# Altium schematic sheet MAXIM-ADC2.SchDoc
size B
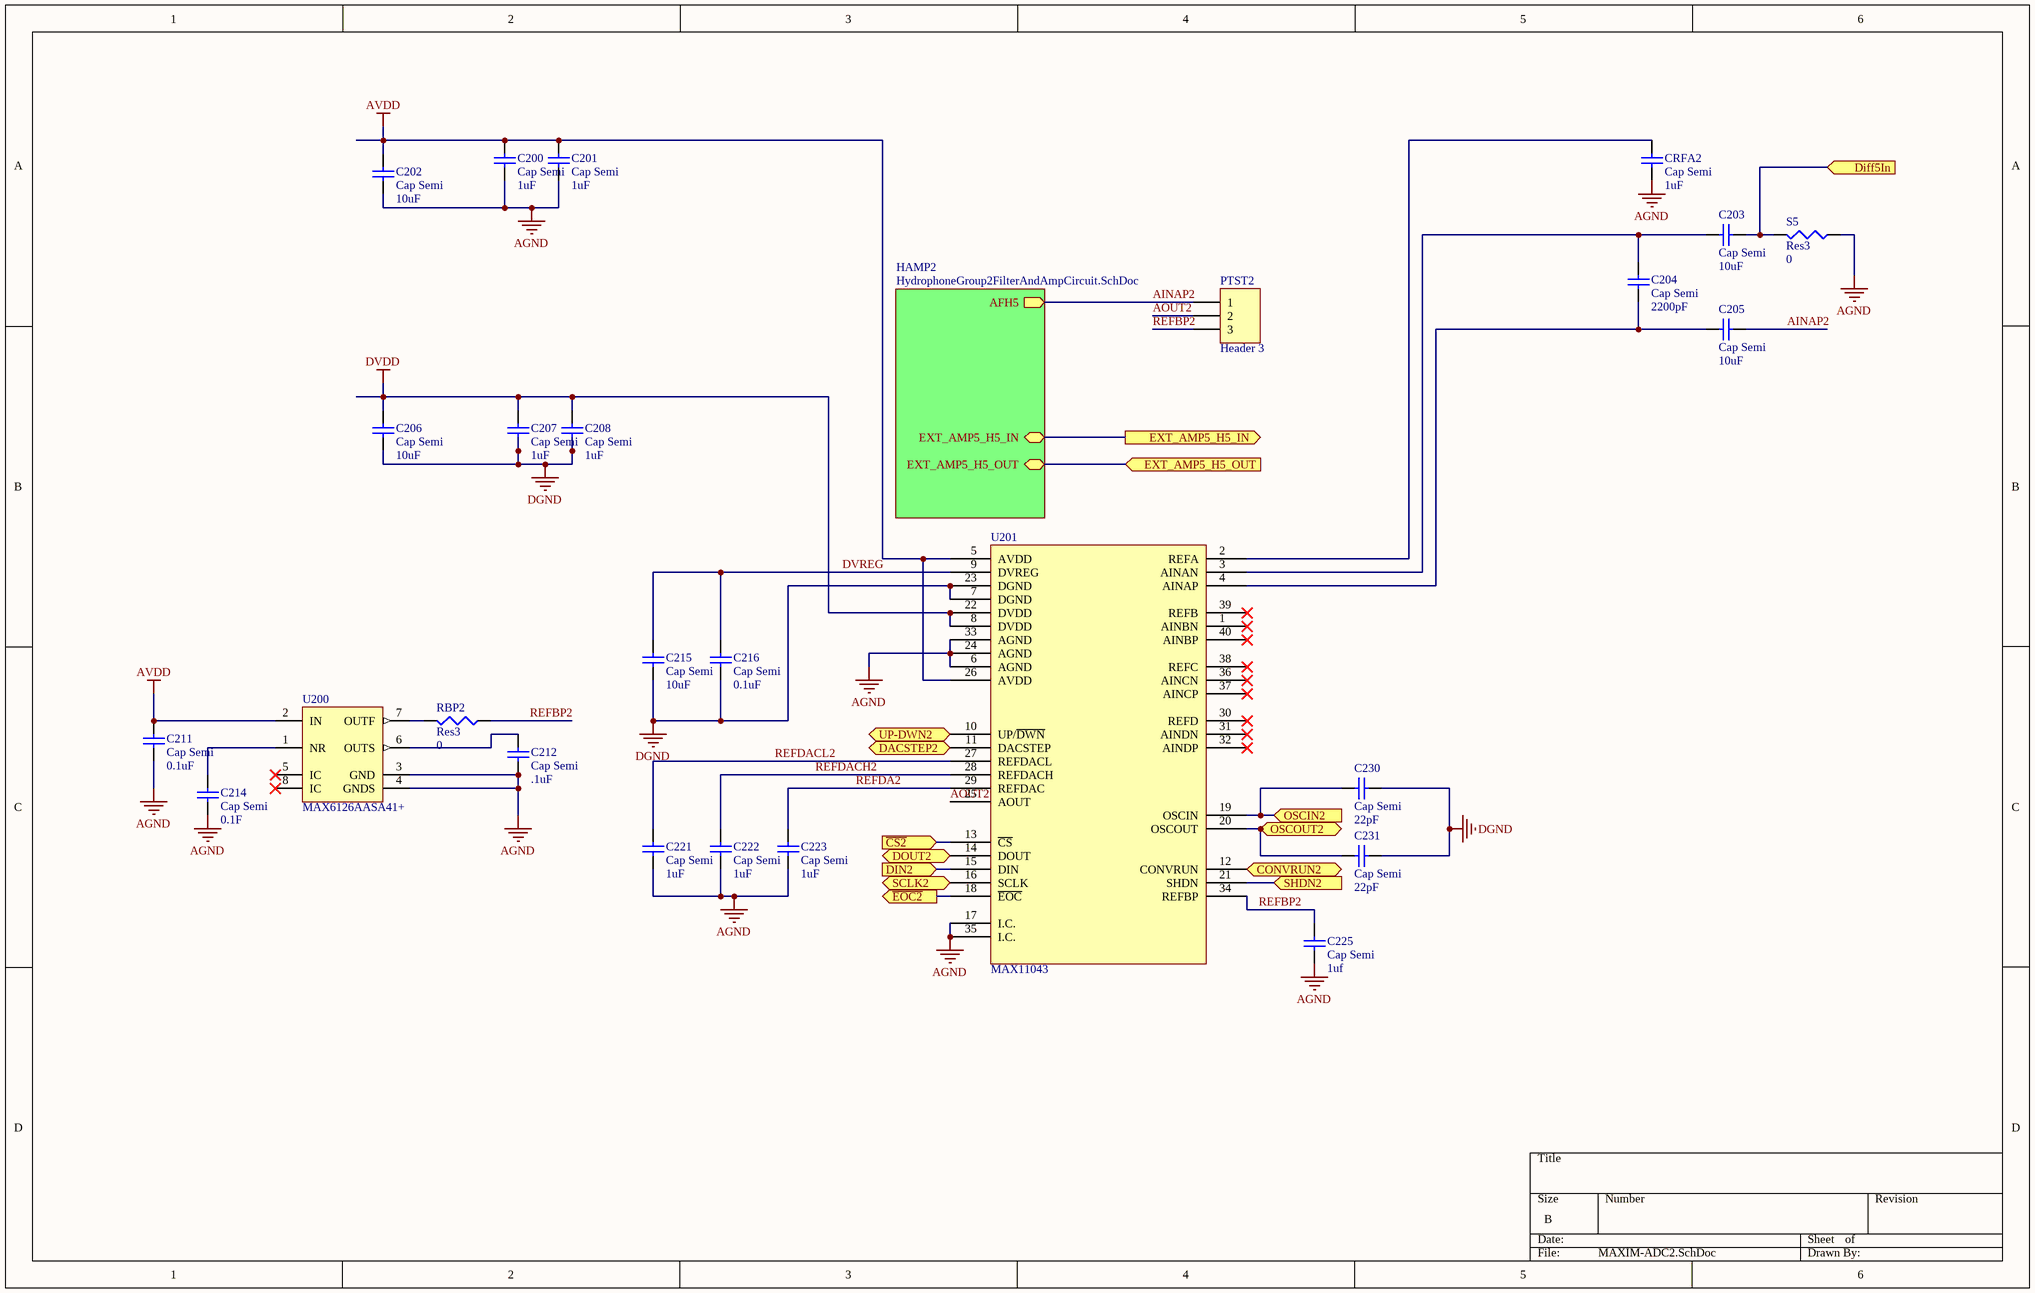
[diagram p0: MAXIM-ADC2.SchDoc]

## Parts
C200  Cap Semi  value 1uF  [1608[0603]]
C201  Cap Semi  value 1uF  [1608[0603]]
C202  Cap Semi  value 10uF  [1608[0603]]
C203  Cap Semi  value 10uF  [1608[0603]]
C204  Cap Semi  value 2200pF  [1608[0603]]
C205  Cap Semi  value 10uF  [1608[0603]]
C206  Cap Semi  value 10uF  [1608[0603]]
C207  Cap Semi  value 1uF  [1608[0603]]
C208  Cap Semi  value 1uF  [1608[0603]]
C211  Cap Semi  value 0.1uF  [1608[0603]]
C212  Cap Semi  value .1uF  [1608[0603]]
C214  Cap Semi  value 0.1F  [1608[0603]]
C215  Cap Semi  value 10uF  [1608[0603]]
C216  Cap Semi  value 0.1uF  [1608[0603]]
C221  Cap Semi  value 1uF  [1608[0603]]
C222  Cap Semi  value 1uF  [1608[0603]]
C223  Cap Semi  value 1uF  [1608[0603]]
C225  Cap Semi  value 1uf  [1608[0603]]
C230  Cap Semi  value 22pF  [1608[0603]]
C231  Cap Semi  value 22pF  [1608[0603]]
CRFA2  Cap Semi  value 1uF  [1608[0603]]
PTST2  Header 3  [HDR1X3]
RBP2  Res3  value 0  [J1-0603]
S5  Res3  value 0  [J1-0603]
U200  MAX6126AASA41+  [MAXM-S8+4_M]
U201  MAX11043  [QFN50P600X600X80_HS-41N]

## Sub-sheets
HAMP2 = HydrophoneGroup2FilterAndAmpCircuit.SchDoc: AFH5 (out), EXT_AMP5_H5_IN, EXT_AMP5_H5_OUT

## Ports
CONVRUN2 (in), DACSTEP2 (in), Diff5In (in), DIN2 (in), DOUT2, EXT_AMP5_H5_IN (out), EXT_AMP5_H5_OUT (in), OSCIN2 (in), OSCOUT2 (out), SCLK2 (in), SHDN2 (in), UP-DWN2 (in), ~{CS2} (in), ~{EOC2} (out)

## Nets
AGND: C200.2 C201.2 C202.2 C211.2 C212.2 C214.2 C221.1 C222.2 C223.1 C225.2 CRFA2.1 S5.1 U200.3(GND) U200.4(GNDS) U201.6(AGND) U201.17(I.C.) U201.24(AGND) U201.33(AGND) U201.35(I.C.)
AVDD: C200.1 C201.1 C202.1 C211.1 U200.2(IN) U201.5(AVDD) U201.26(AVDD)
DGND: C206.2 C207.2 C208.2 C215.2 C216.2 C230.2 C231.2 U201.7(DGND) U201.23(DGND)
DVDD: C206.1 C207.1 C208.1 U201.8(DVDD) U201.22(DVDD)
AINAP2: C205.1 PTST2.1 ; sheet HAMP2/AFH5
AOUT2: PTST2.2 U201.25(AOUT)
~{CS2}: U201.13(~{CS}) ; port ~{CS2}
CONVRUN2: U201.12(CONVRUN) ; port CONVRUN2
DACSTEP2: U201.11(DACSTEP) ; port DACSTEP2
Diff5In: C203.1 S5.2 ; port Diff5In
DIN2: U201.15(DIN) ; port DIN2
DOUT2: U201.14(DOUT) ; port DOUT2
DVREG: C215.1 C216.1 U201.9(DVREG)
~{EOC2}: U201.18(~{EOC}) ; port ~{EOC2}
EXT_AMP5_H5_IN: port EXT_AMP5_H5_IN, sheet HAMP2/EXT_AMP5_H5_IN
EXT_AMP5_H5_OUT: port EXT_AMP5_H5_OUT, sheet HAMP2/EXT_AMP5_H5_OUT
OSCIN2: C230.1 U201.19(OSCIN) ; port OSCIN2
OSCOUT2: C231.1 U201.20(OSCOUT) ; port OSCOUT2
REFBP2: C225.1 PTST2.3 RBP2.1 U201.34(REFBP)
REFDA2: C223.2 U201.29(REFDAC)
REFDACH2: C222.1 U201.28(REFDACH)
REFDACL2: C221.2 U201.27(REFDACL)
SCLK2: U201.16(SCLK) ; port SCLK2
SHDN2: U201.21(SHDN) ; port SHDN2
UP-DWN2: U201.10(UP/~{DWN}) ; port UP-DWN2
NetC203_2: C203.2 C204.2 U201.3(AINAN)
NetC204_1: C204.1 C205.2 U201.4(AINAP)
NetC212_1: C212.1 U200.6(OUTS)
NetC214_1: C214.1 U200.1(NR)
NetCRFA2_2: CRFA2.2 U201.2(REFA)
NetRBP2_2: RBP2.2 U200.7(OUTF)

Not connected (* = marked no-connect by the designer): U200 5(IC)* 8(IC)*; U201 1(AINBN)* 30(REFD)* 31(AINDN)* 32(AINDP)* 36(AINCN)* 37(AINCP)* 38(REFC)* 39(REFB)* 40(AINBP)*

## Library data of the parts
C200-C208 C211 C212 C214-C216 C221-C223 C225 C230 C231 CRFA2 = Cap Semi: Capacitor (Semiconductor SIM Model); Published: 8-Jun-2000; LatestRevisionDate: 29-May-2009; LatestRevisionNote: IPC-7351 Footprint Added.; PackageReference: C1206; Publisher: Altium Limited; PackageDescription: Chip Capacitor
PTST2 = Header 3: ADC2 Signal Test Header; LatestRevisionDate: 17-Jul-2002; LatestRevisionNote: Re-released for DXP Platform.; Publisher: Altium Limited
RBP2 S5 = Res3: Resistor; Published: 8-Jun-2000; LatestRevisionDate: 29-May-2009; LatestRevisionNote: IPC-7351 Footprint Added.; PackageReference: J1-0603; Publisher: Altium Limited; PackageDescription: Chip Resistor
U200 = CMP-0977-00016-1: Ultra-High-Precision, Ultra-Low-Noise, Series Voltage Reference, 4.096 V, -40 to 125 degC, 8-Pin SOIC (S8+4), RoHS, Tube; Manufacturer: Maxim; Output Voltage Accuracy: 0.02% Max.; Line Regulation: 60 uV/V Max.; VOUT: 4.096 V; Dropout Voltage@10 mA: 0.1 V Typ.; VIN: 4.3 to 12.6 V; Operating Temperature: -40 to 125 degC; ComponentLink3URL: http://pdfserv.maximintegrated.com/package_dwgs/21-0041.PDF; PartNumber: MAX6126AASA41+; RoHS: TRUE; ComponentLink3Description: Package Specification; ComponentLink1URL: http://www.maximintegrated.com/; Mounting Technology: Surface Mount; Packing: Tube; DatasheetVersion: Rev. 6; ComponentLink1Description: Manufacturer URL; ComponentLink2URL: http://datasheets.maximintegrated.com/en/ds/MAX6126.pdf; PackageDescription: 8-Pin Small Outline Integrated Circuit Package, Body 4.9 x 3.9 mm, Pitch 1.27 mm; ComponentLink2Description: Datasheet; PackageVersion: Rev. E